# EAGLE design 2in-2out_1.0f_produziert_re (EAGLE 6.6.0)
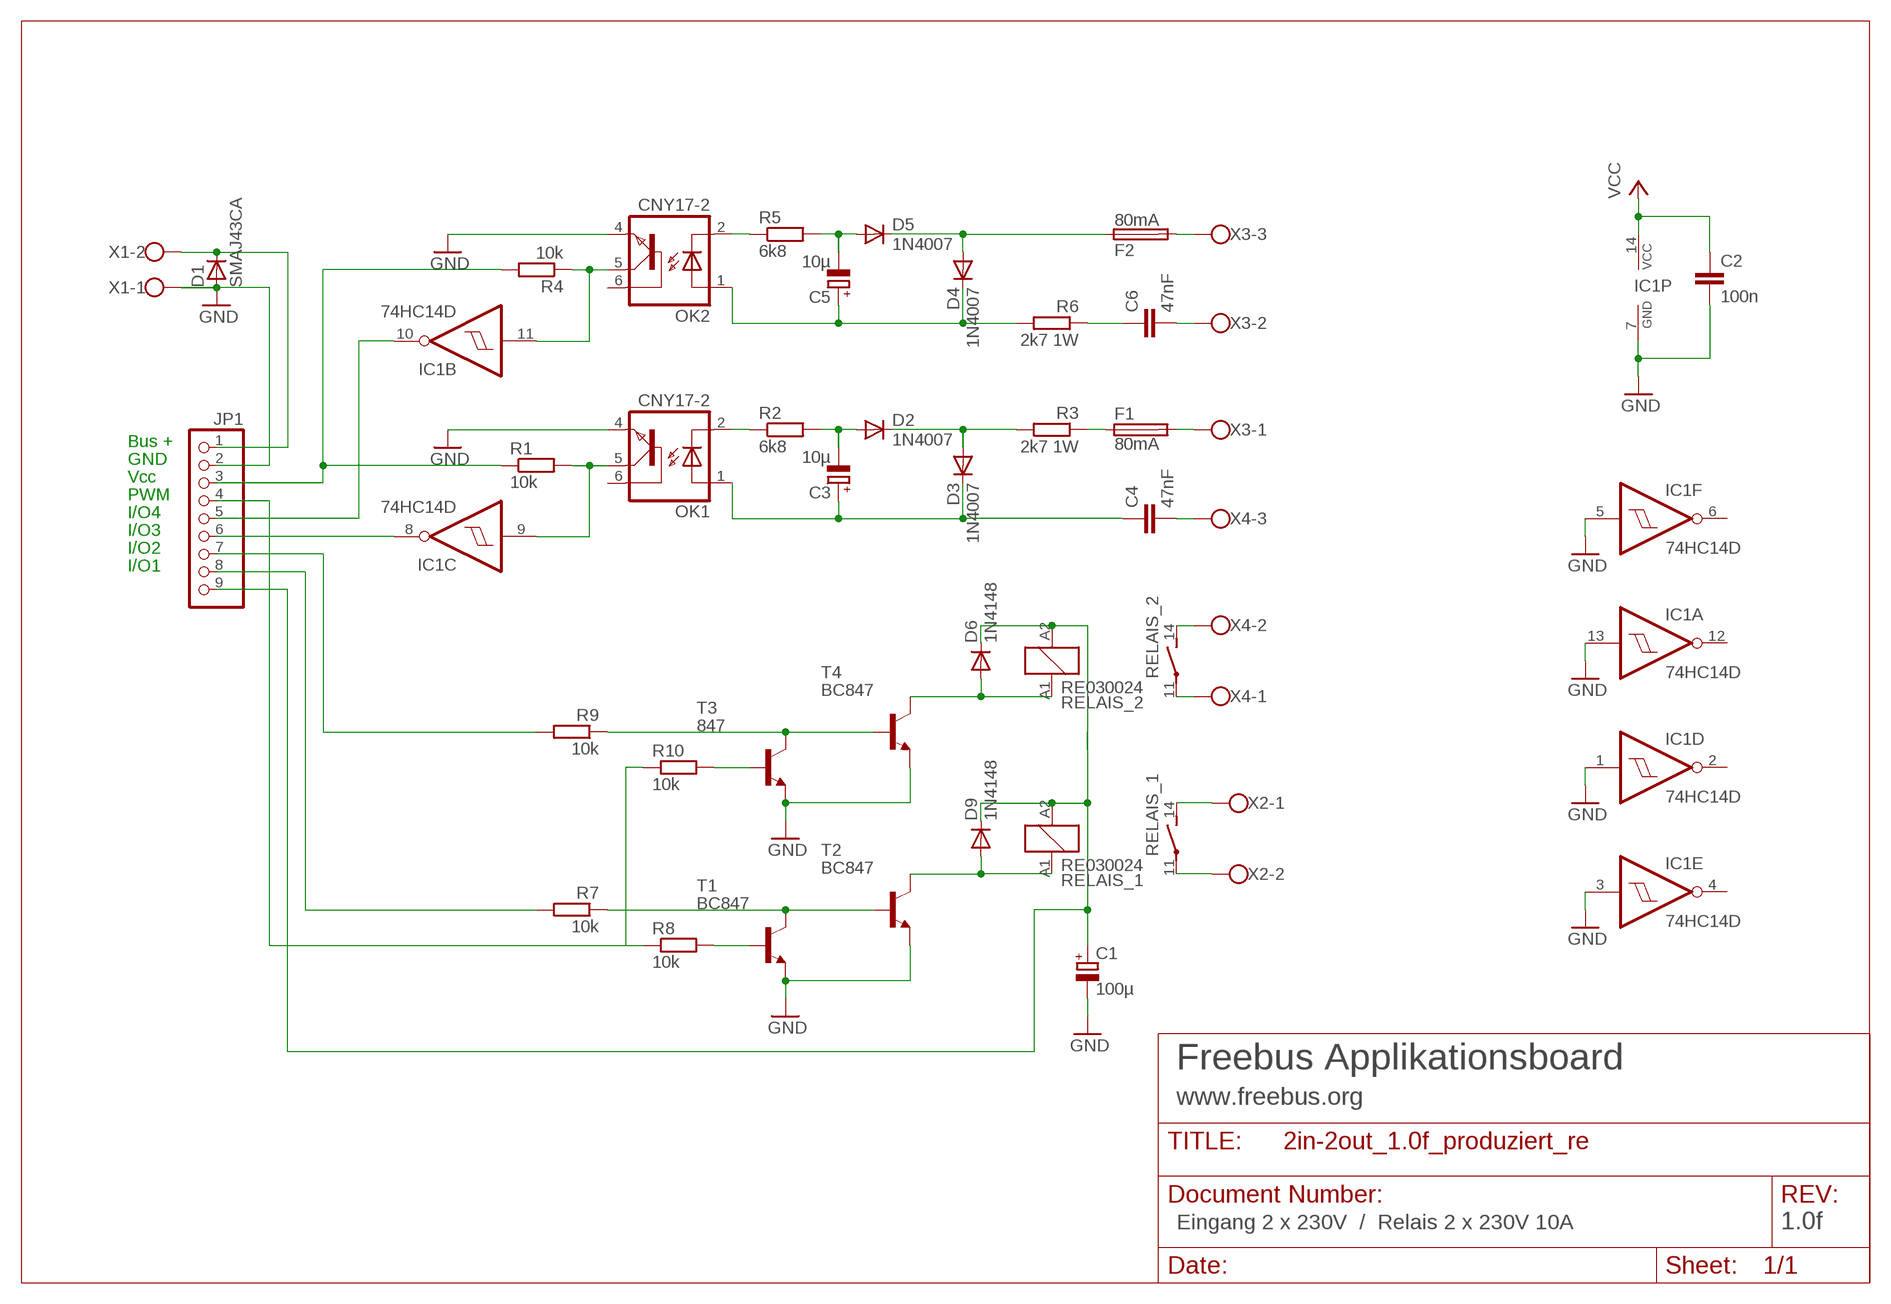
[diagram p0: schematic, sheet 1]

## Parts
C1  100µ  CPOL-EUE3.5-8  [E3,5-8]
C2  100n  C-EUC1206  [C1206]
C3  10µ  CPOL-EUE2-4  [E2-4]
C4  47nF  C-EU075-063X106  [C075-063X106]
C5  10µ  CPOL-EUE2-4  [E2-4]
C6  47nF  C-EU075-063X106  [C075-063X106]
D1  SMAJ43CA  D-SMB  [SMB]
D2  1N4007  DIODE-D-2.5  [D-2.5]
D3  1N4007  DIODE-D-2.5  [D-2.5]
D4  1N4007  DIODE-D-2.5  [D-2.5]
D5  1N4007  DIODE-D-2.5  [D-2.5]
D6  1N4148  DIODE-MINIMELF  [MINIMELF]
D9  1N4148  DIODE-MINIMELF  [MINIMELF]
F1  80mA  FUSE  [0617V]
F2  80mA  FUSE  [0617V]
IC1  74HC14D  [SO14]
JP1  PINHD-1X9  [1X09]
OK1  CNY17-2  CNY17  [DIL06]
OK2  CNY17-2  CNY17  [DIL06]
R1  10k  R-EU_M1206  [M1206]
R2  6k8  R-EU_0207/2V  [0207/2V]
R3  2k7 1W  R-EU_0207/2V  [0207/2V]
R4  10k  R-EU_M1206  [M1206]
R5  6k8  R-EU_0207/2V  [0207/2V]
R6  2k7 1W  R-EU_0207/2V  [0207/2V]
R7  10k  R-EU_M1206  [M1206]
R8  10k  R-EU_M1206  [M1206]
R9  10k  R-EU_M1206  [M1206]
R10  10k  R-EU_M1206  [M1206]
RELAIS_1  RE030024  [RE-SCHRACK]
RELAIS_2  RE030024  [RE-SCHRACK]
T1  BC847  [SOT23]
T2  BC847  [SOT23]
T3  847  BC847  [SOT23]
T4  BC847  [SOT23]
X1  W237-02P  [W237-132]
X2  W237-02P  [W237-132]
X3  W237-3E  [W237-3E]
X4  W237-3E  [W237-3E]

## Nets
EIB+: D1.1(C) JP1.1 X1.2
GND: C1.- C2.2 D1.2(A) IC1.1(D:I) IC1.3(E:I) IC1.5(F:I) IC1.7(P:GND) IC1.13(A:I) JP1.2 OK1.4(EMI) OK2.4(EMI) T1.2(E) T2.2(E) T3.2(E) T4.2(E) X1.1
IO1: JP1.7 R9.2
IO2: JP1.8 R7.2
IO3: IC1.8(C:O) JP1.6
IO4: IC1.10(B:O) JP1.5
N$1: OK1.2(C) R2.1
N$2: RELAIS_1.11(2:P) X2.2
N$3: C3.- D2.A R2.2
N$5: D2.C D3.A R3.2
N$6: RELAIS_1.14(2:S) X2.1
N$7: F1.1 R3.1
N$8: RELAIS_2.14(2:S) X4.2
N$9: RELAIS_2.11(2:P) X4.1
N$10: OK2.2(C) R5.1
N$11: C6.1 R6.1
N$12: F2.2 X3.3
N$13: C5.- D5.A R5.2
N$14: R7.1 T1.3(C) T2.1(B)
N$15: C4.2 X4.3
N$17: R9.1 T3.3(C) T4.1(B)
N$18: D4.A D5.C F2.1
N$19: D6.A RELAIS_2.A1 T4.3(C)
N$20: C5.+ D4.C OK2.1(A) R6.2
N$21: R8.2 T1.1(B)
N$22: R10.2 T3.1(B)
N$24: C3.+ C4.1 D3.C OK1.1(A)
N$25: C6.2 X3.2
N$26: F1.2 X3.1
N$28: IC1.11(B:I) OK2.5(COL) R4.1
N$29: IC1.9(C:I) OK1.5(COL) R1.2
PWM: JP1.4 R8.1 R10.1
R3: D9.A RELAIS_1.A1 T2.3(C)
VCC: C2.1 IC1.14(P:VCC) JP1.3 R1.1 R4.2
VDD_IN: C1.+ D6.C D9.C JP1.9 RELAIS_1.A2 RELAIS_2.A2
Unconnected: IC1.2(D:O) IC1.4(E:O) IC1.6(F:O) IC1.12(A:O) OK1.6(BAS) OK2.6(BAS)

## Notes on the sheet
- Bus +
- GND
- Vcc
- PWM
- I/O4
- I/O3
- I/O2
- I/O1
- Freebus Applikationsboard
- www.freebus.org
- Eingang 2 x 230V  /  Relais 2 x 230V 10A | 1.0f

## Library data of the parts
C1 C3 C5 = rcl:CPOL-EU: POLARIZED CAPACITOR, European symbol
C2 C4 C6 = rcl:C-EU: CAPACITOR, European symbol
D1 = semicon-smd-ipc:D-: DIODE unfilled
D2-D6 D9 = diode:DIODE-: DIODE
F1 F2 = fuse:FUSE: Fuse
IC1 = 74xx-eu:74*14: Hex schmitt trigger INVERTER
JP1 = pinhead:PINHD-1X9: PIN HEADER
OK1 OK2 = optocoupler:CNY17: SIEMENS OPTO COUPLER
R1-R10 = rcl:R-EU_: RESISTOR, European symbol
RELAIS_1 RELAIS_2 = relay:RE03*: Miniature PCB Relay 1 pole 6 A SCHRACK Source: http://www.schrack.com/.. 5812.pdf
T1-T4 = transistor:BC847: NPN TRANSISTOR
X1 X2 = con-wago-508:W237-02P: WAGO SREW CLAMP
X3 X4 = con-wago-508:W237-3E: WAGO SREW CLAMP

## Board
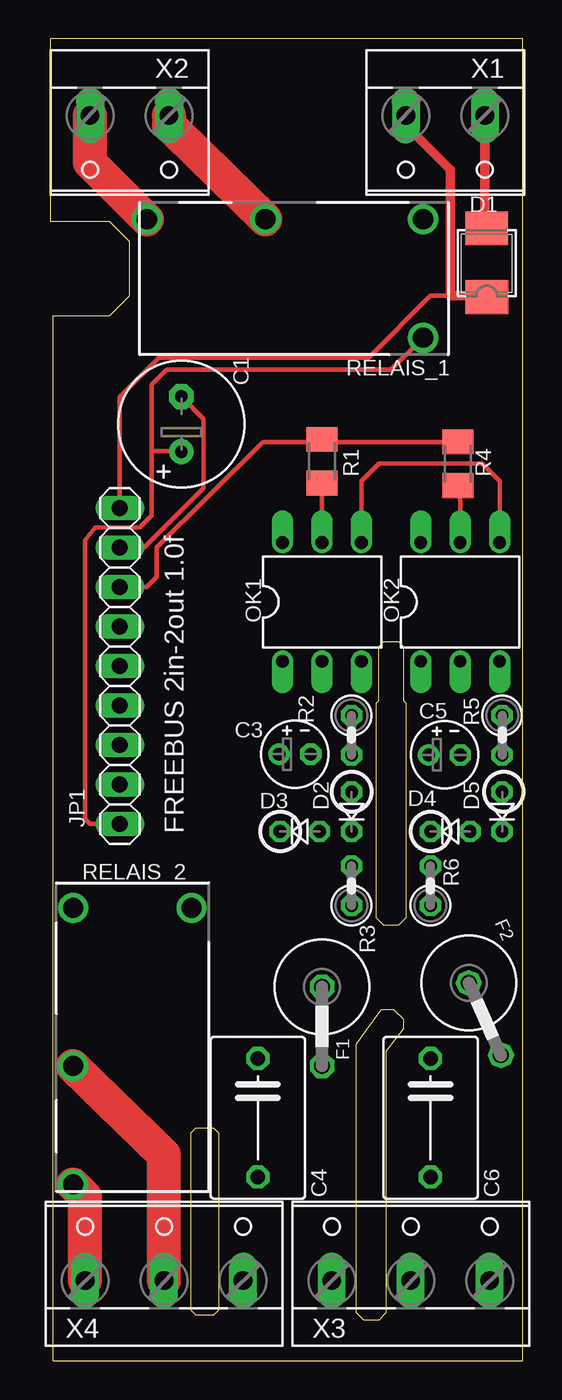
[diagram p1: board, top side]
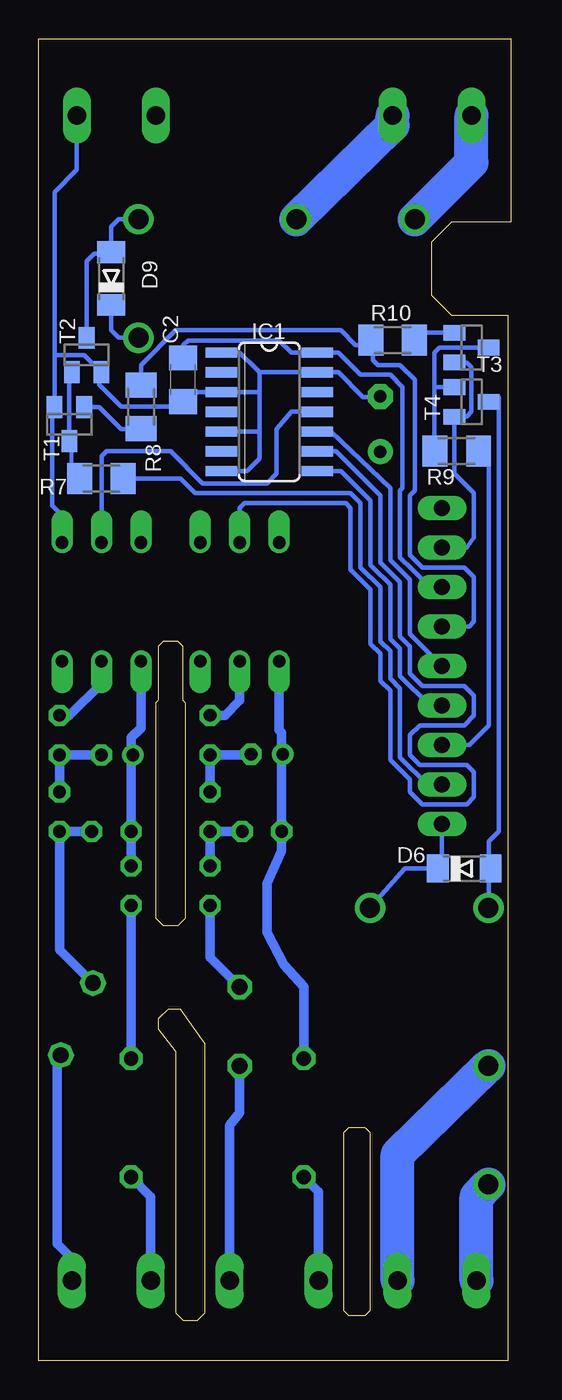
[diagram p2: board, bottom side, seen from below]

Size 30.38 x 85 mm. Coordinates in mm from the lower left corner, seen from the top.
Outline: 0.18,0 0.18,67.21 3.81,67.21 5.08,68.48 5.08,71.97 3.81,73.24 0,73.24 0,85 30.38,85 30.38,0 0.18,0
Outline: 20.96,42.29 21.11,42.45 21.11,45.94 21.43,46.25 22.38,46.25 22.7,45.94 22.7,42.45 22.86,42.29 22.86,28.47 22.38,28 21.43,28 20.96,28.47 20.96,42.29
Outline: 9.05,14.66 9.37,14.98 10.48,14.98 10.8,14.66 10.8,3.23 10.48,2.92 9.37,2.92 9.05,3.23 9.05,14.66
Outline: 19.69,20.38 21.27,22.6 22.07,22.6 22.7,21.97 22.7,21.33 21.59,19.9 21.59,3.07 21.11,2.6 20.16,2.6 19.69,3.07 19.69,20.38
Copper layers (1*16): Top 0.035mm / dielectric 1.5mm / Bottom 0.035mm
Design rules "default_freebus": minimum track width 10mil, minimum drill 24mil, track to track 8mil, track to pad 8mil, pad to pad 8mil, via to via 8mil, smd to smd 8mil, copper to edge 12mil, drill to drill 8mil, minimum pad ring 11mil, minimum via ring 8mil, stop-mask expansion 4mil, vias tented up to drill 0mil, thermal gap 10mil

### Footprints (pad centres in the part's own frame; a part is rotated, then mirrored left to right if it is on the bottom)
E3,5-8 = drill 0.813 pad 1.6: + -1.778,0 | drill 0.813 pad 1.6 octagon: - 1.778,0
C1206 = smd 1.6 x 1.8: 1 -1.4,0; 2 1.4,0
E2-4 = drill 0.813 pad 1.27: + -1.016,0 | drill 0.813 pad 1.27 octagon: - 1.016,0
C075-063X106 = drill 0.914 octagon: 1 -3.81,0; 2 3.81,0
SMB = smd 2.159 x 2.743: 1 -2.311,-0.127; 2 2.108,-0.102
D-2.5 = drill 0.813 octagon: A 1.27,0; C -1.27,0
MINIMELF = smd 1.4 x 1.8: A 1.7,0; C -1.7,0
0617V = drill 1.016 octagon: 1 -2.54,0; 2 2.54,0
SO14 = smd 0.66 x 2.032: 1 -3.81,-3.073; 2 -2.54,-3.073; 3 -1.27,-3.073; 4 0,-3.073; 5 1.27,-3.073; 6 2.54,-3.073; 7 3.81,-3.073; 8 3.81,3.073; 9 2.54,3.073; 10 1.27,3.073; 11 0,3.073; 12 -1.27,3.073; 13 -2.54,3.073; 14 -3.81,3.073
1X09 = drill 1.016 long: 1 -10.16,0; 2 -7.62,0; 3 -5.08,0; 4 -2.54,0; 5 0,0; 6 2.54,0; 7 5.08,0; 8 7.62,0; 9 10.16,0
DIL06 = drill 0.813 offset: 1 -2.54,-3.81; 2 0,-3.81; 3 2.54,-3.81; 4 2.54,3.81; 5 0,3.81; 6 -2.54,3.81
M1206 = smd 1.6 x 2: 1 -1.4,0; 2 1.4,0
0207/2V = drill 0.813 octagon: 1 -1.27,0; 2 1.27,0
RE-SCHRACK = drill 1.3: 11 8.89,-3.81; 14 1.27,-3.81; A1 -8.89,-3.81; A2 -8.89,3.81
SOT23 = smd 1 x 1.4: 1 -0.95,-1.1; 2 0.95,-1.1; 3 0,1.1
W237-132 = drill 1.194 long: 1 -2.54,-0.635; 2 2.54,-0.635
W237-3E = drill 1.194 long: 1 -5.08,-0.635; 2 0,-0.635; 3 5.08,-0.635

### Placement (x,y rotation side)
C1  8.41,60.23 90 top
C2  21.11,63.08 270 bottom
C3  15.72,39 0 top
C4  13.33,15.62 270 top
C5  25.35,38.95 0 top
C6  24.45,15.62 270 top
D1  27.94,70.7 90 top
D2  19.37,35.3 90 top
D3  16.03,34.03 0 top
D4  25.72,34.03 0 top
D5  29.05,35.3 90 top
D6  3.02,31.65 0 bottom
D9  25.72,69.59 90 bottom
F1  17.46,21.49 270 top
F2  27.94,21.97 294 top
IC1  15.56,61.02 270 bottom
JP1  4.45,44.67 270 top
OK1  17.46,48.8 0 top
OK2  26.35,48.8 0 top
R1  17.46,57.84 270 top
R2  19.37,40.22 270 top
R3  19.37,30.54 90 top
R4  26.19,57.69 90 top
R5  29.05,40.22 270 top
R6  24.45,30.54 90 top
R7  26.35,56.73 0 bottom
R8  23.81,61.34 270 bottom
R9  3.49,58.48 0 bottom
R10  7.62,65.62 0 bottom
RELAIS_1  15.08,69.59 180 top
RELAIS_2  5.26,20.22 270 top
T1  28.42,60.23 180 bottom
T2  27.3,64.67 0 bottom
T3  2.54,65.15 270 bottom
T4  2.54,61.65 270 bottom
X1  25.4,79.43 180 top
X2  5.08,79.43 180 top
X3  23.18,5.77 0 top
X4  7.3,5.77 0 top

### Tracks (layer width: path | path; a pad name or v marks a point on that pad's centre or on a via)
EIB+
  Top 0.254: 28.1,68.39 28.1,68.32 | 28.1,68.39 D1.1 | 28.1,68.48 28.1,68.39
  Top 0.305: JP1.1 4.45,61.97 6.99,64.51 20.48,64.51 24.45,68.48 25.72,68.48
  Top 0.61: X1.2 22.86,79.43 25.72,76.58 25.72,68.48 28.1,68.48
GND
  Top 0.254: 27.94,72.61 27.94,72.81 D1.2
  Top 0.305: JP1.2 6.03,52.29 9.84,56.1 9.84,60.54 C1.- | OK2.4 28.89,56.57 27.78,57.68 21.11,57.68 20,56.57 OK1.4
  Top 0.61: X1.1 27.94,72.81
  Bottom 0.254: 29.53,61.01 T1.2 29.37,61.64 | 21.11,62.29 21.11,61.84 | 18.73,62.29 | 18.73,62.29 IC1.3 | 26.51,63.56 26.51,63.57 T2.2 | C2.2 21.27,61.68 21.27,61.34 | 12.54,63.56 | 12.7,63.56
  Bottom 0.305: IC1.1 17.62,64.83 17.46,64.83 16.35,63.72 16.19,63.56 | 12.54,63.56 16.19,63.56 | 29.53,61.01 29.53,54.99 28.89,54.35 OK2.4 | 29.37,64.67 29.37,61.64 | 26.51,63.72 27.46,64.67 29.37,64.67 | 29.37,64.67 29.37,75.15 27.94,76.58 X1.1 | 21.27,61.34 25.08,61.34 26.51,62.77 26.51,63.72 | JP1.2 2.86,52.29 2.38,52.92 2.38,55.78 3.65,57.05 T4.2 2.86,60.7 2.54,61.02 2.54,63.88 2.86,64.19 3.18,64.19 3.18,64.2 T3.2 | 21.11,61.84 C2.2 | IC1.3 21.11,62.29 | 16.19,59.75 IC1.5 | 16.19,62.29 18.73,62.29 | 16.99,57.21 16.19,58 16.19,59.75 | 16.99,57.21 | 16.99,57.21 IC1.7 | 16.19,62.29 16.19,59.75 | 12.54,63.56 IC1.13 11.11,63.56 9.52,61.97 8.41,61.97 C1.- | 12.54,63.56 12.7,63.56 | 26.51,63.72 | 26.51,63.72 | 26.51,63.72 26.51,63.57 | 16.19,63.56 16.19,62.29
IO1
  Bottom 0.254: JP1.7 4.45,39.43
  Bottom 0.305: JP1.7 2.7,39.59 1.43,40.86 1.43,58.95 R9.2
IO2
  Bottom 0.305: R7.2 21.27,56.73 20.32,55.78 10.32,55.78 9.68,55.14 9.68,51.02 8.41,49.75 8.41,46.25 7.78,45.62 7.78,43.87 7.14,43.24 7.14,38.79 5.4,37.05 JP1.8
IO3
  Bottom 0.254: 12.54,57.21 | 12.54,57.21 IC1.8
  Bottom 0.305: JP1.6 5.24,42.13 7.14,44.03 7.14,45.78 7.78,46.41 7.78,49.91 8.89,51.02 9.05,51.18 9.05,55.3 10.95,57.21 12.54,57.21
IO4
  Bottom 0.254: 12.54,59.75 | 12.54,59.75 IC1.10
  Bottom 0.305: JP1.5 6.51,46.73 6.51,50.22 7.78,51.49 7.78,56.1 11.59,59.75 12.54,59.75
N$1
  Bottom 0.61: R2.1 18.42,41.49 17.46,42.45 OK1.2
N$2
  Top 2.184: X2.2 2.54,77.05 RELAIS_1.11
  Bottom 2.184: RELAIS_1.11 2.54,77.05 X2.2
N$3
  Bottom 0.61: C3.- 16.51,39 16.51,38.95 R2.2 D2.A
N$5
  Bottom 0.61: D2.C | R3.2 D2.C | D2.C D3.A | D3.A
N$6
  Top 0.254: 8.02,79.05 7.62,78.64 X2.1
  Top 2.184: X2.1 7.62,79.43 8.02,79.05 RELAIS_1.14 | X2.1
  Bottom 2.184: X2.1 7.62,79.43 RELAIS_1.14
N$7
  Bottom 0.61: F1.1 19.37,25.93 R3.1
N$8
  Top 2.184: 1.43,18.95 7.3,13.24 X4.2 | X4.2
  Bottom 2.184: RELAIS_2.14 7.3,13.24 X4.2
N$9
  Top 0.254: 2.22,6.25 2.54,6.25 X4.1
  Top 2.184: 1.43,11.33 2.22,10.54 2.22,6.25 X4.1 | X4.1
  Bottom 2.184: RELAIS_2.11 2.22,10.54 X4.1
N$10
  Bottom 0.61: R5.1 28.42,41.49 26.35,43.56 OK2.2
N$11
  Bottom 0.61: C6.1 R6.1
N$12
  Bottom 0.61: X3.3 28.26,6.57 29.21,7.52 29.21,19.58 29.13,19.67 F2.2
N$13
  Bottom 0.61: C5.- R5.2 D5.A
N$14
  Bottom 0.254: 28.42,63.25 T2.1 | 28.42,59.28 T1.3 28.26,59.44 28.26,56.89 R7.1
  Bottom 0.305: 28.42,59.28 28.42,63.25
N$15
  Bottom 0.61: X4.3 12.38,10.85 C4.2
N$17
  Bottom 0.305: R9.1 4.92,58.8 4.92,62.61 | T4.1 3.33,62.6 3.33,62.61 4.92,62.61 | T3.3 4.13,65.15 4.6,65.15 4.92,64.83 4.92,62.61
N$18
  Bottom 0.61: D4.A D5.C 29.05,26.42 F2.1
N$19
  Bottom 0.254: 1.43,31.65 | 1.43,31.65 D6.A
  Bottom 0.305: RELAIS_2.A1 1.43,29.11 1.43,31.65 1.43,33.4 0.79,34.03 0.79,61.97 T4.3
N$20
  Bottom 0.61: 24.45,38.95 D4.C R6.2 | 24.45,38.95 C5.+ | 24.45,38.95 24.45,40.06 23.81,40.7 OK2.1
N$21
  Bottom 0.254: 24.45,59.91 24.45,59.94 R8.2
  Bottom 0.305: T1.1 26.51,61.32 25.08,59.91 24.45,59.91
N$22
  Bottom 0.305: R10.2 6.03,65.31 6.03,66.1 T3.1
N$24
  Bottom 0.61: 14.76,39.16 14.76,40.38 14.92,40.54 OK1.1 | 14.76,39.16 C3.+ | 14.76,39.16 D3.C 14.76,32.76 15.72,30.7 15.72,27.52 14.6,25.46 13.33,24.03 C4.1
N$25
  Bottom 0.61: X3.2 23.18,10.54 C6.2
N$26
  Bottom 0.61: X3.1 18.1,15.14 17.46,15.93 F1.2
N$28
  Top 0.254: 26.35,55.17 R4.1
  Top 0.305: 26.35,55.3 26.35,55.17 OK2.5
  Bottom 0.254: 12.54,61.02 12.7,61.02 IC1.11
  Bottom 0.305: OK2.5 26.35,58.16 26.03,58.48 21.91,58.48 19.84,56.41 15.72,56.41 15.08,57.05 15.08,59.91 14.13,61.02 12.54,61.02
N$29
  Top 0.305: OK1.5 R1.2
  Bottom 0.305: IC1.9 11.27,58.48 8.41,55.62 8.41,51.34 7.14,50.06 7.14,46.57 6.51,45.94 6.51,44.19 5.71,43.4 3.02,43.4 2.38,42.76 2.38,42.29 2.38,41.49 3.02,40.86 5.87,40.86 6.51,40.22 6.51,38.95 5.87,38.32 2.86,38.32 2.38,37.84 2.38,36.25 2.86,35.78 5.71,35.78 6.51,36.57 6.51,37.37 7.78,38.63 7.78,43.08 8.41,43.71 8.41,45.46 9.05,46.1 9.05,49.59 10.32,50.86 10.32,54.83 10.64,55.14 17.14,55.14 17.46,54.83 OK1.5
PWM
  Bottom 0.305: JP1.4 2.7,47.21 2.38,47.52 2.38,50.38 3.02,51.02 5.71,51.02 6.51,51.81 6.51,55.62 6.19,55.94 6.19,63.08 7.14,64.04 7.94,64.04 8.57,64.04 8.89,64.35 8.89,65.31 | R8.1 23.81,64.01 21.59,66.26 10.95,66.26 10,65.31 8.89,65.31 | 8.89,65.31 R10.1
R3
  Bottom 0.254: 25.72,71.18 25.56,71.13 D9.A
  Bottom 0.305: RELAIS_1.A1 25.24,73.4 25.72,72.93 25.72,71.18 26.83,71.18 27.31,70.7 T2.3
VCC
  Top 0.305: JP1.3 6.19,49.75 6.83,50.38 6.83,52.29 13.65,59.09 17.46,59.09 | 17.46,59.27 R1.1 17.46,59.09 | 17.46,59.09 R4.2
  Bottom 0.305: JP1.3 5.08,49.75 5.24,49.75 6.35,50.86 7.14,51.65 7.14,55.94 6.99,56.1 6.99,62.61 7.78,63.4 9.68,63.4 11.11,64.83 IC1.14 14.13,64.83 14.92,65.59 20.8,65.59 21.11,65.31 C2.1
VDD_IN
  Top 0.305: RELAIS_1.A2 21.91,63.72 7.46,63.72 6.51,62.77 6.51,58.48 | C1.+ 7.94,58.48 6.51,58.48 | JP1.9 2.54,34.51 2.22,34.82 2.22,52.76 2.86,53.56 5.71,53.56 6.51,54.35 6.51,58.48
  Bottom 0.254: 4.92,31.65 | D6.C 4.92,31.65 | 25.72,67.73 D9.C
  Bottom 0.305: RELAIS_2.A2 6.83,31.65 4.92,31.65 | D6.C 4.45,31.65 JP1.9 | RELAIS_1.A2 25.24,65.78 25.72,66.26 25.72,66.73 25.72,67.73

### Text on the board
tNames: FREEBUS 2in-2out 1.0f